# EAGLE schematic lopo (EAGLE 7.6.0)
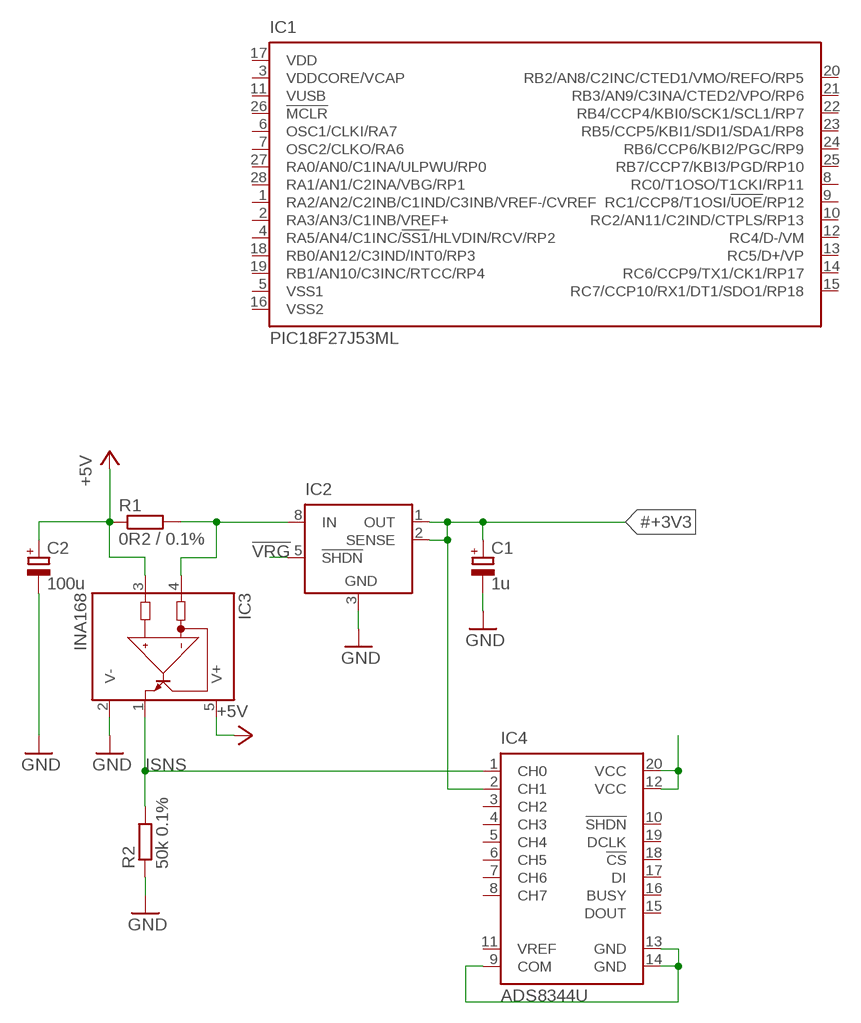
[diagram p0: schematic, sheet 1]

## Parts
C1  1u  CPOL-EUSANYO_SMD_B6  [SANYO-OSCON_SMD_B6]
C2  100u  CPOL-EUSANYO_SMD_B6  [SANYO-OSCON_SMD_B6]
IC1  PIC18F27J53ML  [QFN28-ML_6X6MM]
IC2  LT1129CS8  [SOIC8]
IC3  INA168  [SOT23-5]
IC4  ADS8344U  [SSOP20BU]
R1  0R2 / 0.1%  R-EU_R1206  [R1206]
R2  50k 0.1%  R-EU_R1206  [R1206]

## Nets
!VRG: IC2.5(!SHDN)
#+3V3: C1.+ IC2.1(OUT) IC2.2(SENSE) IC4.2(CH1)
+5V: C2.+ IC3.3(IN+) IC3.5(V+) R1.1
GND: C1.- C2.- IC2.3(GND) IC3.2(V-) R2.1
ISNS: IC3.1(OUT) IC4.1(CH0) R2.2
N$1: IC2.8(IN) IC3.4(IN-) R1.2
N$3: IC4.9(COM) IC4.13(GND) IC4.14(GND)
N$4: IC4.12(VCC) IC4.20(VCC)
Unconnected: IC1.1(RA2/AN2/C2INB/C1IND/C3INB/VREF-/CVREF) IC1.2(RA3/AN3/C1INB/VREF+) IC1.3(VDDCORE/VCAP) IC1.4(RA5/AN4/C1INC/!SS1!/HLVDIN/RCV/RP2) IC1.5(VSS1) IC1.6(OSC1/CLKI/RA7) IC1.7(OSC2/CLKO/RA6) IC1.8(RC0/T1OSO/T1CKI/RP11) IC1.9(RC1/CCP8/T1OSI/!UOE!/RP12) IC1.10(RC2/AN11/C2IND/CTPLS/RP13) IC1.11(VUSB) IC1.12(RC4/D-/VM) IC1.13(RC5/D+/VP) IC1.14(RC6/CCP9/TX1/CK1/RP17) IC1.15(RC7/CCP10/RX1/DT1/SDO1/RP18) IC1.16(VSS2) IC1.17(VDD) IC1.18(RB0/AN12/C3IND/INT0/RP3) IC1.19(RB1/AN10/C3INC/RTCC/RP4) IC1.20(RB2/AN8/C2INC/CTED1/VMO/REFO/RP5) IC1.21(RB3/AN9/C3INA/CTED2/VPO/RP6) IC1.22(RB4/CCP4/KBI0/SCK1/SCL1/RP7) IC1.23(RB5/CCP5/KBI1/SDI1/SDA1/RP8) IC1.24(RB6/CCP6/KBI2/PGC/RP9) IC1.25(RB7/CCP7/KBI3/PGD/RP10) IC1.26(!MCLR) IC1.27(RA0/AN0/C1INA/ULPWU/RP0) IC1.28(RA1/AN1/C2INA/VBG/RP1) IC2.4(NC) IC4.3(CH2) IC4.4(CH3) IC4.5(CH4) IC4.6(CH5) IC4.7(CH6) IC4.8(CH7) IC4.10(!SHDN) IC4.11(VREF) IC4.15(DOUT) IC4.16(BUSY) IC4.17(DI) IC4.18(!CS) IC4.19(DCLK)

## Power pins joined to a net without a drawn wire
GND: IC2.6(GND) IC2.7(GND)

## Library data of the parts
C1 C2 = rcl:CPOL-EU: POLARIZED CAPACITOR, European symbol
IC1 = microchip:PIC18F2*J53: PIC18F47J53 Family High-Performance USB Microcontrollers with nanoWatt XLP Technology Source: Data sheet <http://ww1.microchip.com/downloads/en/DeviceDoc/39964B.pdf>; MPN: PIC18F27J53-I/ML; OC_FARNELL: 1814994; OC_NEWARK: 63R7837
IC2 = linear-technology:LT1129CS8: VOLTAGE REGULATOR with shutdown; MPN: LT1129CS8-5#PBF; OC_FARNELL: 1273576; OC_NEWARK: 57M2078
IC3 = burr-brown:INA168: High-Side Measurement Current Shunt Monitor; MF: TEXAS INSTRUMENTS; MPN: INA168NA/250; OC_FARNELL: 4375737; OC_NEWARK: 35C1744
IC4 = burr-brown:ADS8344: 16-Bit, 8-Channel Serial Output Sampling ADC; MPN: ADS8344NB; OC_FARNELL: 1212294; OC_NEWARK: 01M6827
R1 R2 = rcl:R-EU_: RESISTOR, European symbol